# Altium schematic sheet MCU_POWER.SchDoc
size B; SheetNumber: 2; SheetTotal: 7
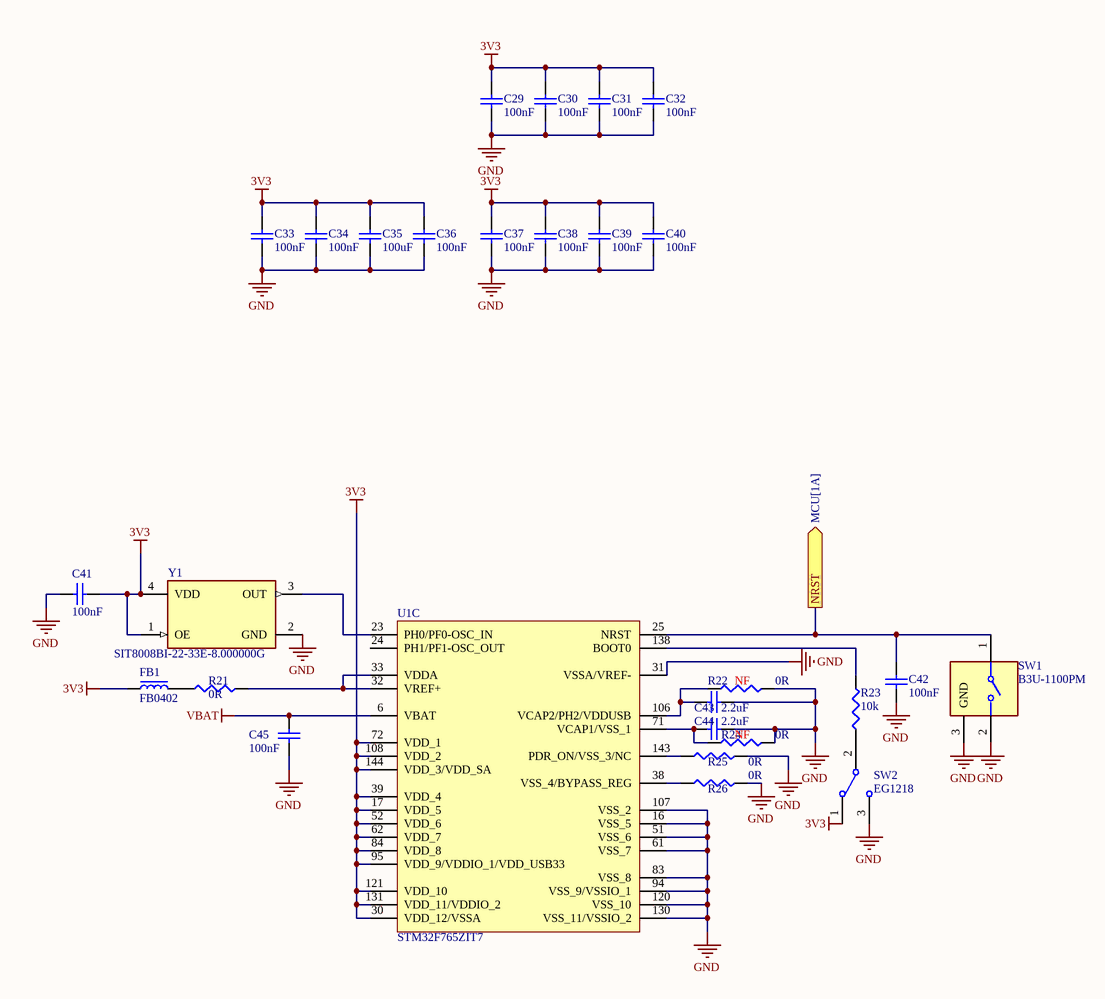
[diagram p0: MCU_POWER.SchDoc]

## Parts
C29  100nF  [0402_C]
C30  100nF  [0402_C]
C31  100nF  [0402_C]
C32  100nF  [0402_C]
C33  100nF  [0402_C]
C34  100nF  [0402_C]
C35  100uF  [0402_C]
C36  100nF  [0402_C]
C37  100nF  [0402_C]
C38  100nF  [0402_C]
C39  100nF  [0402_C]
C40  100nF  [0402_C]
C41  100nF  [0402_C]
C42  100nF  [0402_C]
C43  2.2uF  [0402_C]
C44  2.2uF  [0402_C]
C45  100nF  [0402_C]
FB1  FB0402  [0402_R]
R21  0R  [0402_R]
R22  0R  [0402_R]
R23  10k  [0402_R]
R24  0R  [0402_R]
R25  0R  [0402_R]
R26  0R  [0402_R]
SW1  B3U-1100PM  [FP-B3U-1100PM-MFG]
SW2  EG1218  [ESWI-EG1218_V]
U1  STM32F765ZIT7  [QFP50P2200X2200X160-144N]  (part C of 3)
Y1  SIT8008BI-22-33E-8.000000G  [FP-SiT8008-2-MFG]

## Ports
NRST (out, see MCU[1A])

## Nets
3V3: C29.1 C30.1 C31.1 C32.1 C33.1 C34.1 C35.1 C36.1 C37.1 C38.1 C39.1 C40.1 C41.1 FB1.1 SW2.1 U1.17(VDD_5) U1.30(VDD_12/VSSA) U1.39(VDD_4) U1.52(VDD_6) U1.62(VDD_7) U1.72(VDD_1) U1.84(VDD_8) U1.95(VDD_9/VDDIO_1/VDD_USB33) U1.108(VDD_2) U1.121(VDD_10) U1.131(VDD_11/VDDIO_2) U1.144(VDD_3/VDD_SA) Y1.1(OE) Y1.4(VDD)
GND: C29.2 C30.2 C31.2 C32.2 C33.2 C34.2 C35.2 C36.2 C37.2 C38.2 C39.2 C40.2 C41.2 C42.2 C43.2 C44.2 C45.2 R22.2 R24.2 R25.2 R26.2 SW1.2 SW1.3(GND) SW2.3 U1.16(VSS_5) U1.31(VSSA/VREF-) U1.51(VSS_6) U1.61(VSS_7) U1.83(VSS_8) U1.94(VSS_9/VSSIO_1) U1.107(VSS_2) U1.120(VSS_10) U1.130(VSS_11/VSSIO_2) Y1.2(GND)
VBAT: C45.1 U1.6(VBAT)
NRST: C42.1 SW1.1 U1.25(NRST) ; port NRST
NetC43_1: C43.1 R22.1 U1.106(VCAP2/PH2/VDDUSB)
NetC44_1: C44.1 R24.1 U1.71(VCAP1/VSS_1)
NetFB1_2: FB1.2 R21.1
NetR21_2: R21.2 U1.32(VREF+) U1.33(VDDA)
NetR23_1: R23.1 U1.138(BOOT0)
NetR23_2: R23.2 SW2.2(COM)
NetR25_1: R25.1 U1.143(PDR_ON/VSS_3/NC)
NetR26_1: R26.1 U1.38(VSS_4/BYPASS_REG)
NetU1_23: U1.23(PH0/PF0-OSC_IN) Y1.3(OUT)

Not connected (* = marked no-connect by the designer): U1 24(PH1/PF1-OSC_OUT)

## Notes on the sheet
- (near R22) NF
- (near R24) NF

## Library data of the parts
C29-C34 C36-C42 C45 = C_100nF_0402: Ceramic Capacitor, Multilayer, Ceramic, 16V, 10% +Tol, 10% -Tol, X7R, +-15% TC, 100nF, Surface Mount, 0402 inch; Manufacturer: Samsung Electro-Mechanics; Manufacturer Part Number: CL05B104KO5NNNC; Supplier: DigiKey; Supplier Part Number: 1276-1001-1-ND; RoHS: Compliant; Category: Ceramic Capacitors; Stock: 253470; Pricing: 1=0.08, 10=0.009, 50=0.0076, 100=0.0064, 500=0.0056, 1000=0.004, 2500=0.00394 (USD); Value: 100nF; Case/Package: 0402; Case Code (Imperial): 0402; Case Code (Metric): 1005; China RoHS: Compliant; Contact Plating: Tin; Depth: 500µm; Dielectric: X7R; Dielectric Material: Ceramic; Height: 500µm; Lead Free: Lead Free; Length: 1mm; Lifecycle Status: Production; Material: Ceramic; Max Operating Temperature: 125°C; Min Operating Temperature: -55°C; Mounting Technology: Surface Mount; Number of Terminals: 2; Radiation Hardening: No; REACH SVHC: Yes; Schedule B: 8532240020, 8532240020|8532240020|8532240020|8532240020|8532240020|8532240020|8532240020|8532240020|8532240020|8532240020|8532240020|8532240020|8532240020|8532240020|8532240020|8532240020|8532240020|8532240020|8532240020|8532240020|8532240020|8532240020|8532240020|85; Thickness: 558.8µm; Tolerance: 10%; Voltage: 16V; Voltage Rating: 16V; Voltage Rating (DC): 16V; Width: 500µm; ComponentLink1URL: https://datasheet.octopart.com:443/CL05B104KO5NNNC-Samsung-Electro-Mechanics-datasheet-181960518.pdf?src-supplier=IHS; ComponentLink1Description: https://datasheet.octopart.com:443/CL05B104KO5NNNC-Samsung-Electro-Mechanics-datasheet-181960518.pdf?src-supplier=IHS; ComponentLink2URL: https://datasheet.octopart.com:443/CL05B104KO5NNNC-Samsung-Electro-Mechanics-datasheet-81461623.pdf?src-supplier=Upverter; ComponentLink2Description: https://datasheet.octopart.com:443/CL05B104KO5NNNC-Samsung-Electro-Mechanics-datasheet-81461623.pdf?src-supplier=Upverter; ComponentLink3URL: https://datasheet.octopart.com/CL05B104KO5NNNC-Samsung-Electro-Mechanics-datasheet-8324245.pdf; ComponentLink3Description: https://datasheet.octopart.com/CL05B104KO5NNNC-Samsung-Electro-Mechanics-datasheet-8324245.pdf; ComponentLink4URL: https://datasheet.octopart.com/CL05B104KO5NNNC-Samsung-Electro-Mechanics-datasheet-97040617.pdf; ComponentLink4Description: https://datasheet.octopart.com/CL05B104KO5NNNC-Samsung-Electro-Mechanics-datasheet-97040617.pdf; ComponentLink5URL: https://datasheet.octopart.com/General-Multilayer-Ceramic-Capacitors-Samsung-datasheet-family-111.pdf; ComponentLink5Description: https://datasheet.octopart.com/General-Multilayer-Ceramic-Capacitors-Samsung-datasheet-family-111.pdf; ComponentLink6URL: https://datasheet.octopart.com:443/CL05B104KO5NNNC-Samsung-Electro-Mechanics-datasheet-141346863.pdf?src-supplier=Samsung+SCT; ComponentLink6Description: https://datasheet.octopart.com:443/CL05B104KO5NNNC-Samsung-Electro-Mechanics-datasheet-141346863.pdf?src-supplier=Samsung+SCT; ComponentLink7URL: https://datasheet.octopart.com:443/CL05B104KO5NNNC-Samsung-datasheet-151956582.pdf?src-supplier=SOS+electronic; ComponentLink7Description: https://datasheet.octopart.com:443/CL05B104KO5NNNC-Samsung-datasheet-151956582.pdf?src-supplier=SOS+electronic; ComponentLink8URL: https://datasheet.octopart.com:443/CL05B104KO5NNNC-Samsung-datasheet-42485123.pdf?src-supplier=Future+Electronics; ComponentLink8Description: https://datasheet.octopart.com:443/CL05B104KO5NNNC-Samsung-datasheet-42485123.pdf?src-supplier=Future+Electronics; ComponentLink9URL: https://datasheet.octopart.com:443/CL05B104KO5NNNC-Samsung-datasheet-34153835.pdf?src-supplier=Future+Electronics; ComponentLink9Description: https://datasheet.octopart.com:443/CL05B104KO5NNNC-Samsung-datasheet-34153835.pdf?src-supplier=Future+Electronics; ComponentLink10URL: https://datasheet.octopart.com:443/CL05B104KO5NNNC-Samsung-datasheet-26589024.pdf?src-supplier=Future+Electronics; ComponentLink10Description: https://datasheet.octopart.com:443/CL05B104KO5NNNC-Samsung-datasheet-26589024.pdf?src-supplier=Future+Electronics; ComponentLink11URL: https://datasheet.octopart.com:443/CL05B104KO5NNNC-Samsung-Electro-Mechanics-datasheet-149136714.pdf?src-supplier=Future+Electronics; ComponentLink11Description: https://datasheet.octopart.com:443/CL05B104KO5NNNC-Samsung-Electro-Mechanics-datasheet-149136714.pdf?src-supplier=Future+Electronics; ComponentLink12URL: https://datasheet.octopart.com:443/CL05B104KO5NNNC-Samsung-datasheet-59220082.pdf?src-supplier=TME; ComponentLink12Description: https://datasheet.octopart.com:443/CL05B104KO5NNNC-Samsung-datasheet-59220082.pdf?src-supplier=TME; ComponentLink13URL: http://sigma.octopart.com:80/rohs_certificate/General-Multilayer-Ceramic-Capacitors-Samsung-family-110.pdf?src-supplier=Compliance+Statements; ComponentLink13Description: http://sigma.octopart.com:80/rohs_certificate/General-Multilayer-Ceramic-Capacitors-Samsung-family-110.pdf?src-supplier=Compliance+Statements; ComponentLink14URL: http://sigma.octopart.com:80/rohs_statement/General-Multilayer-Ceramic-Capacitors-Samsung-family-132.pdf?src-supplier=Compliance+Statements; ComponentLink14Description: http://sigma.octopart.com:80/rohs_statement/General-Multilayer-Ceramic-Capacitors-Samsung-family-132.pdf?src-supplier=Compliance+Statements; ComponentLink15URL: http://sigma.octopart.com:80/reach_statement/General-Multilayer-Ceramic-Capacitors-Samsung-family-133.pdf?src-supplier=Compliance+Statements; ComponentLink15Description: http://sigma.octopart.com:80/reach_statement/General-Multilayer-Ceramic-Capacitors-Samsung-family-133.pdf?src-supplier=Compliance+Statements; LCSC Part #: C1525
C35 = C_4.7uF_0402: CAP CER 4.7UF 16V X5R 0402; Manufacturer: Samsung; Manufacturer Part Number: CL05A475MO5NUNC; Dielectric Material: Ceramic; Multilayer: Yes; Tolerance  (fill in as +-): 20%; Supplier: Digikey; Supplier Part Number: 1276-6836-1-ND; RoHS: Yes; Category: Ceramic Capacitors; Stock: 200989; Pricing: 1=0.43, 10=0.252, 50=0.1826, 100=0.161, 500=0.12446, 1000=0.11305, 2500=0.10094, 5000=0.0936, 10000=0.08752, 20000=0.08248, 30000=0.07994, 50000=0.07712, 70000=0.07547, 100000=0.07387 (USD); Mounting Technology: Surface Mount; Pins: 2; Package Shape: Rectangular; Case/Package: 0402; Terminal Finish: Nickel; Min Operating Temperature: -55°C; Max Operating Temperature: 85°C; JESD-609 Code: e3; Value: 4.7uF; Capacitor Type: Ceramic; Package Style: SMTMeter; Packaging: Tape and Reel; Tolerance (fill in as +-): 20%; Rated DC Voltage (URdc): 16V; Temperature Characteristics Code: X5R; Termination: Wraparound; Length: 1mm; Width: 0.5mm; Height: 0.7mm; Reach SVHC Compliant: Yes; RoHS Compliant: Yes; ComponentLink1URL: https://datasheet.ciiva.com:443/pdfs/VipMasterIC/IC/SEMS/SEMS-S-A0008384515/SEMS-S-A0008898881-1.pdf?src-supplier=IHS+Markit; ComponentLink1Description: https://datasheet.ciiva.com:443/pdfs/VipMasterIC/IC/SEMS/SEMS-S-A0008384515/SEMS-S-A0008898881-1.pdf?src-supplier=IHS+Markit; ComponentLink2URL: http://www.farnell.com/datasheets/2710653.pdf?src-supplier=Farnell; ComponentLink2Description: http://www.farnell.com/datasheets/2710653.pdf?src-supplier=Farnell; ComponentLink3URL: http://www.samsungsem.com/kr/support/product-search/mlcc/CL05A475MO5NUNC.jsp?src-supplier=Digikey; ComponentLink3Description: http://www.samsungsem.com/kr/support/product-search/mlcc/CL05A475MO5NUNC.jsp?src-supplier=Digikey; ComponentLink4URL: http://www.farnell.com/datasheets/2710653.pdf?src-supplier=Newark; ComponentLink4Description: http://www.farnell.com/datasheets/2710653.pdf?src-supplier=Newark; ComponentLink5URL: http://www.farnell.com/datasheets/2710653.pdf?src-supplier=Element14; ComponentLink5Description: http://www.farnell.com/datasheets/2710653.pdf?src-supplier=Element14; ComponentLink6URL: https://datasheet.octopart.com/CL05A475MO5NUNC-Samsung-Electro-Mechanics-datasheet-123102911.pdf?src-supplier=Future+Electronics; ComponentLink6Description: https://datasheet.octopart.com/CL05A475MO5NUNC-Samsung-Electro-Mechanics-datasheet-123102911.pdf?src-supplier=Future+Electronics; LCSC Part #: C318563
C43 C44 = C_2.2uF_0402_1: Ceramic Capacitor, Ceramic, 25V, 20% +Tol, 20% -Tol, X5R, 15% TC, 2.2uF, Surface Mount, 0402; Manufacturer: Yageo Group; Manufacturer Part Number: CC0402MRX5R8BB225; Dielectric: C0G; Insulation Resistance: 10GΩ; Temperature Coefficient: 30ppm/°C; Voltage Rating: 50V; Value: 2.2µF; Case/Package: 0402; Case Code (Imperial): 0402; Case Code (Metric): 1005; China RoHS: Compliant; Composition: Ceramic; Depth: 500µm; Dielectric Material: Ceramic; Halogen Free: Halogen Free; Height: 500µm; Lead Free: Lead Free; Length: 1mm; Lifecycle Status: Production; Max Operating Temperature: 125°C; Min Operating Temperature: -55°C; Mounting Technology: Surface Mount; Pins: 2; Number of Terminals: 2; Packaging: Tape & Reel (TR); Radiation Hardening: No; REACH SVHC: Yes; Schedule B: 8532240020, 8532240020|8532240020|8532240020|8532240020|8532240020; Termination: SMD/SMT; Thickness: 558.8µm; Voltage Rating (DC): 50V; Weight: 652.039032µg; Width: 500µm; ComponentLink1URL: https://datasheet.octopart.com:443/CC0402CRNPO9BN2R7-Yageo-datasheet-182140217.pdf?src-supplier=IHS; ComponentLink1Description: https://datasheet.octopart.com:443/CC0402CRNPO9BN2R7-Yageo-datasheet-182140217.pdf?src-supplier=IHS; ComponentLink2URL: https://datasheet.octopart.com:443/CC0402CRNPO9BN2R7-Yageo-datasheet-151948684.pdf?src-supplier=Farnell; ComponentLink2Description: https://datasheet.octopart.com:443/CC0402CRNPO9BN2R7-Yageo-datasheet-151948684.pdf?src-supplier=Farnell; ComponentLink3URL: https://datasheet.octopart.com:443/CC0402CRNPO9BN2R7-Yageo-datasheet-181966735.pdf?src-supplier=Farnell; ComponentLink3Description: https://datasheet.octopart.com:443/CC0402CRNPO9BN2R7-Yageo-datasheet-181966735.pdf?src-supplier=Farnell; ComponentLink4URL: https://datasheet.octopart.com:443/CC0402CRNPO9BN2R7-Yageo-datasheet-137875056.pdf?src-supplier=Future+Electronics; ComponentLink4Description: https://datasheet.octopart.com:443/CC0402CRNPO9BN2R7-Yageo-datasheet-137875056.pdf?src-supplier=Future+Electronics; ComponentLink5URL: https://datasheet.octopart.com:443/CC0402CRNPO9BN2R7-Yageo-datasheet-136957424.pdf?src-supplier=Future+Electronics; ComponentLink5Description: https://datasheet.octopart.com:443/CC0402CRNPO9BN2R7-Yageo-datasheet-136957424.pdf?src-supplier=Future+Electronics; ComponentLink6URL: https://datasheet.octopart.com:443/CC0402CRNPO9BN2R7-Yageo-datasheet-137700082.pdf?src-supplier=Future+Electronics; ComponentLink6Description: https://datasheet.octopart.com:443/CC0402CRNPO9BN2R7-Yageo-datasheet-137700082.pdf?src-supplier=Future+Electronics; ComponentLink7URL: https://datasheet.octopart.com:443/CC0402CRNPO9BN2R7-Yageo-datasheet-78855684.pdf?src-supplier=Future+Electronics; ComponentLink7Description: https://datasheet.octopart.com:443/CC0402CRNPO9BN2R7-Yageo-datasheet-78855684.pdf?src-supplier=Future+Electronics; ComponentLink8URL: https://datasheet.octopart.com:443/CC0402CRNPO9BN2R7-Yageo-datasheet-24578986.pdf?src-supplier=Future+Electronics; ComponentLink8Description: https://datasheet.octopart.com:443/CC0402CRNPO9BN2R7-Yageo-datasheet-24578986.pdf?src-supplier=Future+Electronics; ComponentLink9URL: https://datasheet.octopart.com:443/CC0402CRNPO9BN2R7-Yageo-datasheet-16730043.pdf?src-supplier=Future+Electronics; ComponentLink9Description: https://datasheet.octopart.com:443/CC0402CRNPO9BN2R7-Yageo-datasheet-16730043.pdf?src-supplier=Future+Electronics; ComponentLink10URL: https://datasheet.octopart.com:443/CC0402CRNPO9BN2R7-Yageo-datasheet-12589826.pdf?src-supplier=Future+Electronics; ComponentLink10Description: https://datasheet.octopart.com:443/CC0402CRNPO9BN2R7-Yageo-datasheet-12589826.pdf?src-supplier=Future+Electronics; ComponentLink11URL: https://datasheet.octopart.com:443/CC0402CRNPO9BN2R7-Yageo-datasheet-10406438.pdf?src-supplier=Newark; ComponentLink11Description: https://datasheet.octopart.com:443/CC0402CRNPO9BN2R7-Yageo-datasheet-10406438.pdf?src-supplier=Newark; ComponentLink12URL: https://datasheet.octopart.com:443/CC0402CRNPO9BN2R7-Yageo-datasheet-65873193.pdf?src-supplier=Newark; ComponentLink12Description: https://datasheet.octopart.com:443/CC0402CRNPO9BN2R7-Yageo-datasheet-65873193.pdf?src-supplier=Newark; ComponentLink13URL: https://datasheet.octopart.com:443/CC0402CRNPO9BN2R7-Yageo-datasheet-68296204.pdf?src-supplier=Megastar; ComponentLink13Description: https://datasheet.octopart.com:443/CC0402CRNPO9BN2R7-Yageo-datasheet-68296204.pdf?src-supplier=Megastar; ComponentLink14URL: http://sigma.octopart.com:80/rohs_statement/Yageo-company-2.pdf?src-supplier=Compliance+Statements; ComponentLink14Description: http://sigma.octopart.com:80/rohs_statement/Yageo-company-2.pdf?src-supplier=Compliance+Statements; ComponentLink15URL: http://sigma.octopart.com:80/conflict_mineral_statement/Yageo-company-3.pdf?src-supplier=Compliance+Statements; ComponentLink15Description: http://sigma.octopart.com:80/conflict_mineral_statement/Yageo-company-3.pdf?src-supplier=Compliance+Statements; LCSC Part #: C723363; Supplier: DigiKey; Supplier Part Number: 13-CC0402MRX5R8BB225CT-ND; RoHS: Compliant; Category: Ceramic Capacitors; Stock: 20337; Pricing: 1=0.3, 10=0.176, 50=0.1282, 100=0.1135, 500=0.08336, 1000=0.08124, 2500=0.07321, 5000=0.06838 (USD); Material: Ceramic; ComponentLink16URL: https://datasheet.octopart.com:443/CC0402MRX5R8BB225-Yageo-datasheet-170350636.pdf?src-supplier=IHS; ComponentLink16Description: https://datasheet.octopart.com:443/CC0402MRX5R8BB225-Yageo-datasheet-170350636.pdf?src-supplier=IHS; ComponentLink17URL: https://datasheet.octopart.com:443/CC0402MRX5R8BB225-Yageo-datasheet-78855684.pdf?src-supplier=Upverter; ComponentLink17Description: https://datasheet.octopart.com:443/CC0402MRX5R8BB225-Yageo-datasheet-78855684.pdf?src-supplier=Upverter; ComponentLink18URL: https://datasheet.octopart.com:443/CC0402MRX5R8BB225-Yageo-datasheet-181967557.pdf?src-supplier=Farnell; ComponentLink18Description: https://datasheet.octopart.com:443/CC0402MRX5R8BB225-Yageo-datasheet-181967557.pdf?src-supplier=Farnell; ComponentLink19URL: https://datasheet.octopart.com:443/CC0402MRX5R8BB225-Yageo-datasheet-181967556.pdf?src-supplier=Farnell; ComponentLink19Description: https://datasheet.octopart.com:443/CC0402MRX5R8BB225-Yageo-datasheet-181967556.pdf?src-supplier=Farnell; ComponentLink20URL: https://datasheet.octopart.com:443/CC0402MRX5R8BB225-Yageo-datasheet-145016144.pdf?src-supplier=ODG+(Origin+Data+Global); ComponentLink20Description: https://datasheet.octopart.com:443/CC0402MRX5R8BB225-Yageo-datasheet-145016144.pdf?src-supplier=ODG+(Origin+Data+Global); ComponentLink21URL: https://datasheet.octopart.com/CC0402MRX5R8BB225-Yageo-datasheet-86397281.pdf; ComponentLink21Description: https://datasheet.octopart.com/CC0402MRX5R8BB225-Yageo-datasheet-86397281.pdf; Supplier 1: DigiKey; Supplier Part Number 1: 13-CC0402KRX5R8BB225CT-ND
FB1 = FB_0402: Ferrite Beads Multi-Layer 600Ohm 25% 100MHz 300mA 520mOhm DCR 0402 Paper T/R; Manufacturer: Murata Electronics; Manufacturer Part Number: BLM15AG601SN1D; DC Resistance (DCR): 520mΩ; Impedance: 600Ω; Material: Ferrite, Steel; Number of Circuits: 1; Shielding: Unshielded; Distributor Link: *; LCSC Part #: C76884; Supplier: DigiKey; Supplier Part Number: 490-1006-1-ND; RoHS: Compliant; Category: Ferrite Beads and Chips; Stock: 347218; Pricing: 1=0.1, 10=0.043, 25=0.0376, 50=0.034, 100=0.0305, 250=0.02632, 500=0.02346, 1000=0.02083, 5000=0.01546, 10000=0.01341, 20000=0.01188 (USD); Case/Package: 0402; Case Code (Imperial): 0402; Case Code (Metric): 1005; Core Material: Ferrite; Current Rating: 300mA; DC Current: 300mA; Depth: 550µm; Frequency: 100MHz; Height: 500µm; Lead Free: Lead Free; Length: 1mm; Lifecycle Status: Production; Max Current Rating: 300mA; Max DC Current: 300mA; Clock Frequency: 100MHz; Max Operating Temperature: 125°C; Military Standard: Not; Min Operating Temperature: -55°C; Number of Lines: 1; Pins: 2; Number of Terminals: 2; Packaging: Tape and Reel; Radiation Hardening: No; REACH SVHC: Yes; RMS Current (Irms): 300mA; Schedule B: 8504500000, 8504500000|8504500000, 8504500000|8504500000|8504500000, 8504500000|8504500000|8504500000|8504500000; ESR: 520mΩ; Termination: SMD/SMT; Test Frequency: 100MHz; Tolerance: 25%; Width: 500µm; ComponentLink1URL: https://datasheet.octopart.com:443/BLM15AG601SN1D-Murata-datasheet-180806368.pdf?src-supplier=Newark; ComponentLink1Description: https://datasheet.octopart.com:443/BLM15AG601SN1D-Murata-datasheet-180806368.pdf?src-supplier=Newark; ComponentLink2URL: https://datasheet.octopart.com:443/BLM15AG601SN1D-Murata-datasheet-12522583.pdf?src-supplier=Upverter; ComponentLink2Description: https://datasheet.octopart.com:443/BLM15AG601SN1D-Murata-datasheet-12522583.pdf?src-supplier=Upverter; ComponentLink3URL: https://datasheet.octopart.com:443/BLM15AG601SN1D-Murata-datasheet-10083551.pdf?src-supplier=Upverter; ComponentLink3Description: https://datasheet.octopart.com:443/BLM15AG601SN1D-Murata-datasheet-10083551.pdf?src-supplier=Upverter; ComponentLink4URL: https://datasheet.octopart.com:443/BLM15AG601SN1D-Murata-datasheet-8508678.pdf?src-supplier=Upverter; ComponentLink4Description: https://datasheet.octopart.com:443/BLM15AG601SN1D-Murata-datasheet-8508678.pdf?src-supplier=Upverter; ComponentLink5URL: https://datasheet.octopart.com:443/BLM15AG601SN1D-Murata-datasheet-70271.pdf?src-supplier=element14+APAC; ComponentLink5Description: https://datasheet.octopart.com:443/BLM15AG601SN1D-Murata-datasheet-70271.pdf?src-supplier=element14+APAC; ComponentLink6URL: https://datasheet.octopart.com:443/BLM15AG601SN1D-Murata-datasheet-11772092.pdf?src-supplier=Future+Electronics; ComponentLink6Description: https://datasheet.octopart.com:443/BLM15AG601SN1D-Murata-datasheet-11772092.pdf?src-supplier=Future+Electronics; ComponentLink7URL: https://datasheet.octopart.com:443/BLM15AG601SN1D-Murata-datasheet-13536432.pdf?src-supplier=Future+Electronics; ComponentLink7Description: https://datasheet.octopart.com:443/BLM15AG601SN1D-Murata-datasheet-13536432.pdf?src-supplier=Future+Electronics; ComponentLink8URL: https://datasheet.octopart.com:443/BLM15AG601SN1D-Murata-datasheet-79879196.pdf?src-supplier=Future+Electronics; ComponentLink8Description: https://datasheet.octopart.com:443/BLM15AG601SN1D-Murata-datasheet-79879196.pdf?src-supplier=Future+Electronics; ComponentLink9URL: https://datasheet.octopart.com:443/BLM15AG601SN1D-Murata-datasheet-13563506.pdf?src-supplier=Future+Electronics; ComponentLink9Description: https://datasheet.octopart.com:443/BLM15AG601SN1D-Murata-datasheet-13563506.pdf?src-supplier=Future+Electronics; ComponentLink10URL: https://datasheet.octopart.com:443/BLM15AG601SN1D-Murata-datasheet-12545319.pdf?src-supplier=Future+Electronics; ComponentLink10Description: https://datasheet.octopart.com:443/BLM15AG601SN1D-Murata-datasheet-12545319.pdf?src-supplier=Future+Electronics; ComponentLink11URL: https://datasheet.octopart.com:443/BLM15AG601SN1D-Murata-datasheet-141257741.pdf?src-supplier=Ciiva; ComponentLink11Description: https://datasheet.octopart.com:443/BLM15AG601SN1D-Murata-datasheet-141257741.pdf?src-supplier=Ciiva; ComponentLink12URL: https://datasheet.octopart.com:443/BLM15AG601SN1D-Murata-datasheet-138706486.pdf?src-supplier=Ciiva; ComponentLink12Description: https://datasheet.octopart.com:443/BLM15AG601SN1D-Murata-datasheet-138706486.pdf?src-supplier=Ciiva; ComponentLink13URL: https://datasheet.octopart.com:443/BLM15AG601SN1D-Murata-datasheet-155367977.pdf?src-supplier=TME; ComponentLink13Description: https://datasheet.octopart.com:443/BLM15AG601SN1D-Murata-datasheet-155367977.pdf?src-supplier=TME; ComponentLink14URL: https://datasheet.octopart.com:443/BLM15AG601SN1D-Murata-datasheet-65816644.pdf?src-supplier=TME; ComponentLink14Description: https://datasheet.octopart.com:443/BLM15AG601SN1D-Murata-datasheet-65816644.pdf?src-supplier=TME; ComponentLink15URL: https://datasheet.octopart.com:443/BLM15AG601SN1D-Murata-datasheet-102761981.pdf?src-supplier=Megastar; ComponentLink15Description: https://datasheet.octopart.com:443/BLM15AG601SN1D-Murata-datasheet-102761981.pdf?src-supplier=Megastar; ComponentLink16URL: https://datasheet.octopart.com/BLM15AG601SN1D-Murata-datasheet-37129980.pdf; ComponentLink16Description: https://datasheet.octopart.com/BLM15AG601SN1D-Murata-datasheet-37129980.pdf; ComponentLink17URL: https://datasheet.octopart.com:443/BLM15AG601SN1D-Murata-datasheet-14066398.pdf?src-supplier=iiiC; ComponentLink17Description: https://datasheet.octopart.com:443/BLM15AG601SN1D-Murata-datasheet-14066398.pdf?src-supplier=iiiC; ComponentLink18URL: http://sigma.octopart.com:80/reach_statement/Murata-company-16.pdf?src-supplier=Compliance+Statements; ComponentLink18Description: http://sigma.octopart.com:80/reach_statement/Murata-company-16.pdf?src-supplier=Compliance+Statements
R21 R22 R24-R26 = R_0R_0402: GENERAL PURPOSE CHIP RESISTOR Metal Glaze/thick Film, 0.0625W, 0ohm, Surface Mount, 0402; Manufacturer: Yageo Group; Manufacturer Part Number: RC0402JR-070RL; Max Power Dissipation: 63mW; Power Dissipation: 62.5mW; Value: 0Ω; Temperature Coefficient: 200ppm/°C; Tolerance: 5%; Voltage Rating: 50V; Supplier: DigiKey; Supplier Part Number: 311-0.0JRDKR-ND; RoHS: Compliant; Category: Chip SMD Resistors; Stock: 23041339; Pricing: 1=0.1, 10=0.010, 25=0.0064, 50=0.0054, 100=0.0047, 250=0.00392, 500=0.00346, 1000=0.00304, 5000=0.0023 (USD); Case/Package: 0402; Case Code (Imperial): 0402; China RoHS: Non-Compliant; Composition: Thick Film; Contact Plating: Tin; Depth: 500µm; Features: Moisture Resistant; Height: 350µm; Lead Free: Lead Free; Length: 1mm; Lifecycle Status: Production; Max Operating Temperature: 155°C; Military Standard: Not; Min Operating Temperature: -55°C; Mounting Technology: Surface Mount; Pins: 2; Number of Terminals: 2; Number of Terminations: 2; Packaging: Tape & Reel; Power Rating: 63mW; Radiation Hardening: No; REACH SVHC: Yes; Schedule B: 8533290000, 8533290000|8533290000, 8533290000|8533290000|8533290000, 8533290000|8533290000|8533290000|8533290000; Termination: SMD/SMT; Voltage Rating (DC): 50V; Width: 500µm; ComponentLink1URL: https://datasheet.octopart.com:443/RC0402JR-070RL-Yageo-datasheet-182189538.pdf?src-supplier=IHS; ComponentLink1Description: https://datasheet.octopart.com:443/RC0402JR-070RL-Yageo-datasheet-182189538.pdf?src-supplier=IHS; ComponentLink2URL: https://datasheet.octopart.com:443/RC0402JR-070RL-Yageo-datasheet-10408619.pdf?src-supplier=Newark; ComponentLink2Description: https://datasheet.octopart.com:443/RC0402JR-070RL-Yageo-datasheet-10408619.pdf?src-supplier=Newark; ComponentLink3URL: https://datasheet.octopart.com:443/RC0402JR-070RL-Yageo-datasheet-12531192.pdf?src-supplier=Seeed+Studio; ComponentLink3Description: https://datasheet.octopart.com:443/RC0402JR-070RL-Yageo-datasheet-12531192.pdf?src-supplier=Seeed+Studio; ComponentLink4URL: https://datasheet.octopart.com:443/RC0402JR-070RL-Yageo-datasheet-8324527.pdf?src-supplier=TME; ComponentLink4Description: https://datasheet.octopart.com:443/RC0402JR-070RL-Yageo-datasheet-8324527.pdf?src-supplier=TME; ComponentLink5URL: https://datasheet.octopart.com:443/RC0402JR-070RL-Yageo-datasheet-62067350.pdf?src-supplier=Farnell; ComponentLink5Description: https://datasheet.octopart.com:443/RC0402JR-070RL-Yageo-datasheet-62067350.pdf?src-supplier=Farnell; ComponentLink6URL: https://datasheet.octopart.com:443/RC0402JR-070RL-Yageo-datasheet-8329306.pdf?src-supplier=element14; ComponentLink6Description: https://datasheet.octopart.com:443/RC0402JR-070RL-Yageo-datasheet-8329306.pdf?src-supplier=element14; ComponentLink7URL: https://datasheet.octopart.com:443/RC0402JR-070RL-Yageo-datasheet-505231.pdf?src-supplier=element14; ComponentLink7Description: https://datasheet.octopart.com:443/RC0402JR-070RL-Yageo-datasheet-505231.pdf?src-supplier=element14; ComponentLink8URL: https://datasheet.octopart.com:443/RC0402JR-070RL-Yageo-datasheet-175423674.pdf?src-supplier=SOS+electronic; ComponentLink8Description: https://datasheet.octopart.com:443/RC0402JR-070RL-Yageo-datasheet-175423674.pdf?src-supplier=SOS+electronic; ComponentLink9URL: https://datasheet.octopart.com:443/RC0402JR-070RL-Yageo-datasheet-164759695.pdf?src-supplier=Future+Electronics; ComponentLink9Description: https://datasheet.octopart.com:443/RC0402JR-070RL-Yageo-datasheet-164759695.pdf?src-supplier=Future+Electronics; ComponentLink10URL: https://datasheet.octopart.com:443/RC0402JR-070RL-Yageo-datasheet-137700087.pdf?src-supplier=Future+Electronics; ComponentLink10Description: https://datasheet.octopart.com:443/RC0402JR-070RL-Yageo-datasheet-137700087.pdf?src-supplier=Future+Electronics; ComponentLink11URL: https://datasheet.octopart.com/RC0402JR-070RL-Yageo-datasheet-73766026.pdf; ComponentLink11Description: https://datasheet.octopart.com/RC0402JR-070RL-Yageo-datasheet-73766026.pdf; ComponentLink12URL: http://sigma.octopart.com:80/rohs_statement/Yageo-company-2.pdf?src-supplier=Compliance+Statements; ComponentLink12Description: http://sigma.octopart.com:80/rohs_statement/Yageo-company-2.pdf?src-supplier=Compliance+Statements; ComponentLink13URL: http://sigma.octopart.com:80/conflict_mineral_statement/Yageo-company-3.pdf?src-supplier=Compliance+Statements; ComponentLink13Description: http://sigma.octopart.com:80/conflict_mineral_statement/Yageo-company-3.pdf?src-supplier=Compliance+Statements; LCSC Part #: C60485
R23 = R_10k_0402: RES SMD 10K OHM 0.1% 1/16W 0402; Manufacturer: Yageo Group; Manufacturer Part Number: RC0402FR-071KL; Power Dissipation: 62.5mW; Power Rating: 63mW; Value: 10kΩ; Temperature Coefficient: 100ppm/°C; Tolerance: 1%; Voltage Rating: 50V; LCSC Part #: C191915; Supplier: DigiKey; Supplier Part Number: 311-1.00KLRTR-ND; RoHS: Compliant; Category: Chip SMD Resistors; Stock: 4926888; Pricing: 10000=0.00204, 20000=0.002, 30000=0.00196, 50000=0.00182, 70000=0.00181 (USD); Case/Package: 0402; Case Code (Imperial): 0402; Case Code (Metric): 0402; China RoHS: Non-Compliant; Composition: Thick Film; Depth: 500µm; Height: 350µm; Lead Free: Lead Free; Length: 1mm; Lifecycle Status: Production; Max Operating Temperature: 155°C; Military Standard: Not; Min Operating Temperature: -55°C; Mounting Technology: Surface Mount; Pins: 2; Number of Terminals: 2; Packaging: Tape & Reel; REACH SVHC: Yes; Schedule B: 8533210045, 8533210045|8533210045|8533210045|8533210045|8533210045|8533210045|8533210045|8533210045|8533210045|8533210045|8533210045|8533210045|8533210045|8533210045|8533210045|8533210045|8533210045|8533210045|8533210045|8533210045|8533210045|8533210045|8533210045|85; Termination: SMD/SMT; Voltage Rating (AC): 50V; Voltage Rating (DC): 50V; Width: 500µm; Working Voltage: 50V; ComponentLink1URL: https://datasheet.octopart.com:443/RC0402FR-071KL-Yageo-datasheet-175887523.pdf?src-supplier=IHS; ComponentLink1Description: https://datasheet.octopart.com:443/RC0402FR-071KL-Yageo-datasheet-175887523.pdf?src-supplier=IHS; ComponentLink2URL: https://datasheet.octopart.com:443/RC0402FR-071KL-Yageo-datasheet-164759695.pdf?src-supplier=Upverter; ComponentLink2Description: https://datasheet.octopart.com:443/RC0402FR-071KL-Yageo-datasheet-164759695.pdf?src-supplier=Upverter; ComponentLink3URL: https://datasheet.octopart.com:443/RC0402FR-071KL-Yageo-datasheet-103092701.pdf?src-supplier=Upverter; ComponentLink3Description: https://datasheet.octopart.com:443/RC0402FR-071KL-Yageo-datasheet-103092701.pdf?src-supplier=Upverter; ComponentLink4URL: https://sigma.octopart.com:443/138820526/technical_drawing/Yageo-RC0402FR-071KL.pdf?src-supplier=Upverter; ComponentLink4Description: https://sigma.octopart.com:443/138820526/technical_drawing/Yageo-RC0402FR-071KL.pdf?src-supplier=Upverter; ComponentLink5URL: https://datasheet.octopart.com:443/RC0402FR-071KL-Yageo-datasheet-98239111.pdf?src-supplier=Upverter; ComponentLink5Description: https://datasheet.octopart.com:443/RC0402FR-071KL-Yageo-datasheet-98239111.pdf?src-supplier=Upverter; ComponentLink6URL: https://datasheet.octopart.com:443/RC0402FR-071KL-Yageo-datasheet-10408619.pdf?src-supplier=Newark; ComponentLink6Description: https://datasheet.octopart.com:443/RC0402FR-071KL-Yageo-datasheet-10408619.pdf?src-supplier=Newark; ComponentLink7URL: https://datasheet.octopart.com:443/RC0402FR-071KL-Yageo-datasheet-8324527.pdf?src-supplier=Newark; ComponentLink7Description: https://datasheet.octopart.com:443/RC0402FR-071KL-Yageo-datasheet-8324527.pdf?src-supplier=Newark; ComponentLink8URL: https://datasheet.octopart.com:443/RC0402FR-071KL-Yageo-datasheet-62067350.pdf?src-supplier=Farnell; ComponentLink8Description: https://datasheet.octopart.com:443/RC0402FR-071KL-Yageo-datasheet-62067350.pdf?src-supplier=Farnell; ComponentLink9URL: https://datasheet.octopart.com:443/RC0402FR-071KL-Yageo-datasheet-12531192.pdf?src-supplier=Future+Electronics; ComponentLink9Description: https://datasheet.octopart.com:443/RC0402FR-071KL-Yageo-datasheet-12531192.pdf?src-supplier=Future+Electronics; ComponentLink10URL: https://datasheet.octopart.com:443/RC0402FR-071KL-Yageo-datasheet-137700087.pdf?src-supplier=Future+Electronics; ComponentLink10Description: https://datasheet.octopart.com:443/RC0402FR-071KL-Yageo-datasheet-137700087.pdf?src-supplier=Future+Electronics; ComponentLink11URL: https://datasheet.octopart.com:443/RC0402FR-071KL-Yageo-datasheet-8324255.pdf?src-supplier=Future+Electronics; ComponentLink11Description: https://datasheet.octopart.com:443/RC0402FR-071KL-Yageo-datasheet-8324255.pdf?src-supplier=Future+Electronics; ComponentLink12URL: https://datasheet.octopart.com:443/RC0402FR-071KL-Yageo-datasheet-8329306.pdf?src-supplier=element14; ComponentLink12Description: https://datasheet.octopart.com:443/RC0402FR-071KL-Yageo-datasheet-8329306.pdf?src-supplier=element14; ComponentLink13URL: https://datasheet.octopart.com:443/RC0402FR-071KL-Yageo-datasheet-505231.pdf?src-supplier=element14; ComponentLink13Description: https://datasheet.octopart.com:443/RC0402FR-071KL-Yageo-datasheet-505231.pdf?src-supplier=element14; ComponentLink14URL: https://datasheet.octopart.com:443/RC0402FR-071KL-Yageo-datasheet-175423674.pdf?src-supplier=SOS+electronic; ComponentLink14Description: https://datasheet.octopart.com:443/RC0402FR-071KL-Yageo-datasheet-175423674.pdf?src-supplier=SOS+electronic; ComponentLink15URL: https://datasheet.octopart.com:443/RC0402FR-071KL-Yageo-datasheet-148775077.pdf?src-supplier=TME; ComponentLink15Description: https://datasheet.octopart.com:443/RC0402FR-071KL-Yageo-datasheet-148775077.pdf?src-supplier=TME; ComponentLink16URL: https://datasheet.octopart.com:443/RC0402FR-071KL-Yageo-datasheet-79472498.pdf?src-supplier=Megastar; ComponentLink16Description: https://datasheet.octopart.com:443/RC0402FR-071KL-Yageo-datasheet-79472498.pdf?src-supplier=Megastar; ComponentLink17URL: https://datasheet.octopart.com/RC0402FR-071KL-Yageo-datasheet-73766026.pdf; ComponentLink17Description: https://datasheet.octopart.com/RC0402FR-071KL-Yageo-datasheet-73766026.pdf; ComponentLink18URL: http://sigma.octopart.com:80/rohs_statement/Yageo-company-2.pdf?src-supplier=Compliance+Statements; ComponentLink18Description: http://sigma.octopart.com:80/rohs_statement/Yageo-company-2.pdf?src-supplier=Compliance+Statements; ComponentLink19URL: http://sigma.octopart.com:80/conflict_mineral_statement/Yageo-company-3.pdf?src-supplier=Compliance+Statements; ComponentLink19Description: http://sigma.octopart.com:80/conflict_mineral_statement/Yageo-company-3.pdf?src-supplier=Compliance+Statements; Contact Plating: Tin; Features: Automotive AEC-Q200; Max Power Dissipation: 63mW; Number of Terminations: 2; Radiation Hardening: No; ComponentLink20URL: https://sigma.octopart.com:443/138766958/technical_drawing/Panasonic-ERA-2AEB103X.pdf?src-supplier=Upverter; ComponentLink20Description: https://sigma.octopart.com:443/138766958/technical_drawing/Panasonic-ERA-2AEB103X.pdf?src-supplier=Upverter; ComponentLink21URL: https://datasheet.octopart.com:443/ERA-2AEB103X-Panasonic-datasheet-62287448.pdf?src-supplier=Future+Electronics; ComponentLink21Description: https://datasheet.octopart.com:443/ERA-2AEB103X-Panasonic-datasheet-62287448.pdf?src-supplier=Future+Electronics; ComponentLink22URL: https://datasheet.octopart.com:443/ERA-2AEB103X-Panasonic-datasheet-12510007.pdf?src-supplier=Future+Electronics; ComponentLink22Description: https://datasheet.octopart.com:443/ERA-2AEB103X-Panasonic-datasheet-12510007.pdf?src-supplier=Future+Electronics; ComponentLink23URL: https://datasheet.octopart.com:443/ERA-2AEB103X-Panasonic-datasheet-11763931.pdf?src-supplier=Future+Electronics; ComponentLink23Description: https://datasheet.octopart.com:443/ERA-2AEB103X-Panasonic-datasheet-11763931.pdf?src-supplier=Future+Electronics; ComponentLink24URL: https://datasheet.octopart.com:443/ERA-2AEB103X-Panasonic-datasheet-10840895.pdf?src-supplier=Future+Electronics; ComponentLink24Description: https://datasheet.octopart.com:443/ERA-2AEB103X-Panasonic-datasheet-10840895.pdf?src-supplier=Future+Electronics; ComponentLink25URL: https://datasheet.octopart.com:443/ERA-2AEB103X-Panasonic-datasheet-8367715.pdf?src-supplier=Future+Electronics; ComponentLink25Description: https://datasheet.octopart.com:443/ERA-2AEB103X-Panasonic-datasheet-8367715.pdf?src-supplier=Future+Electronics; ComponentLink26URL: https://datasheet.octopart.com:443/ERA-2AEB103X-Panasonic-datasheet-5392808.pdf?src-supplier=Future+Electronics; ComponentLink26Description: https://datasheet.octopart.com:443/ERA-2AEB103X-Panasonic-datasheet-5392808.pdf?src-supplier=Future+Electronics; ComponentLink27URL: https://datasheet.octopart.com:443/ERA-2AEB103X-Panasonic-datasheet-136531316.pdf?src-supplier=TME; ComponentLink27Description: https://datasheet.octopart.com:443/ERA-2AEB103X-Panasonic-datasheet-136531316.pdf?src-supplier=TME; ComponentLink28URL: https://datasheet.octopart.com:443/ERA2AEB103X-Panasonic-datasheet-188913046.pdf?src-supplier=TME; ComponentLink28Description: https://datasheet.octopart.com:443/ERA2AEB103X-Panasonic-datasheet-188913046.pdf?src-supplier=TME; ComponentLink29URL: https://datasheet.octopart.com:443/ERA-2AEB103X-Panasonic-datasheet-13266200.pdf?src-supplier=_legacy+Avnet; ComponentLink29Description: https://datasheet.octopart.com:443/ERA-2AEB103X-Panasonic-datasheet-13266200.pdf?src-supplier=_legacy+Avnet; ComponentLink30URL: https://datasheet.octopart.com:443/ERA2AEB103X-Panasonic-datasheet-5311861.pdf?src-supplier=Newark; ComponentLink30Description: https://datasheet.octopart.com:443/ERA2AEB103X-Panasonic-datasheet-5311861.pdf?src-supplier=Newark; ComponentLink31URL: https://datasheet.octopart.com:443/ERA-2AEB103X-Panasonic-datasheet-61114971.pdf?src-supplier=Newark; ComponentLink31Description: https://datasheet.octopart.com:443/ERA-2AEB103X-Panasonic-datasheet-61114971.pdf?src-supplier=Newark; ComponentLink32URL: https://datasheet.octopart.com:443/ERA-2AEB103X-Panasonic-datasheet-34200419.pdf?src-supplier=Newark; ComponentLink32Description: https://datasheet.octopart.com:443/ERA-2AEB103X-Panasonic-datasheet-34200419.pdf?src-supplier=Newark; ComponentLink33URL: https://datasheet.octopart.com:443/ERA-2AEB103X-Panasonic-datasheet-7542722.pdf?src-supplier=element14+APAC; ComponentLink33Description: https://datasheet.octopart.com:443/ERA-2AEB103X-Panasonic-datasheet-7542722.pdf?src-supplier=element14+APAC; ComponentLink34URL: https://datasheet.octopart.com:443/ERA-2AEB103X-Panasonic-datasheet-154766165.pdf?src-supplier=Master+Electronics; ComponentLink34Description: https://datasheet.octopart.com:443/ERA-2AEB103X-Panasonic-datasheet-154766165.pdf?src-supplier=Master+Electronics; ComponentLink35URL: https://datasheet.octopart.com:443/ERA-2AEB103X-Panasonic-datasheet-46744048.pdf?src-supplier=RS+(Formerly+Allied+Electronics); ComponentLink35Description: https://datasheet.octopart.com:443/ERA-2AEB103X-Panasonic-datasheet-46744048.pdf?src-supplier=RS+(Formerly+Allied+Electronics); ComponentLink36URL: https://sigma.octopart.com:443/150570796/technical_drawing/Panasonic-ERA2AEB103X.pdf?src-supplier=Panasonic+SCT; ComponentLink36Description: https://sigma.octopart.com:443/150570796/technical_drawing/Panasonic-ERA2AEB103X.pdf?src-supplier=Panasonic+SCT; ComponentLink37URL: https://datasheet.octopart.com/ERA-2AEB103X-Panasonic-datasheet-78375410.pdf; ComponentLink37Description: https://datasheet.octopart.com/ERA-2AEB103X-Panasonic-datasheet-78375410.pdf; ComponentLink38URL: https://datasheet.octopart.com:443/ERA2AEB103X-Panasonic---ECG-datasheet-15994758.pdf?src-supplier=Farnell; ComponentLink38Description: https://datasheet.octopart.com:443/ERA2AEB103X-Panasonic---ECG-datasheet-15994758.pdf?src-supplier=Farnell; ComponentLink39URL: https://datasheet.octopart.com:443/ERA2AEB103X-Panasonic-datasheet-10050158.pdf?src-supplier=Arrow+Electronics; ComponentLink39Description: https://datasheet.octopart.com:443/ERA2AEB103X-Panasonic-datasheet-10050158.pdf?src-supplier=Arrow+Electronics; ComponentLink40URL: https://datasheet.octopart.com:443/ERA-2AEB103X-Panasonic-datasheet-33006989.pdf?src-supplier=Electro+Sonic; ComponentLink40Description: https://datasheet.octopart.com:443/ERA-2AEB103X-Panasonic-datasheet-33006989.pdf?src-supplier=Electro+Sonic
SW1 = CMP-08834-000028-1: SWITCH TACTILE SPST-NO 0.05A 12V; Switch Travel: 0.15mm; Throw Configuration: SPST; Current Rating: 50mA; Illumination Type: Non-Illuminated; Actuator Length: 0.4mm; Operating Force: 1.5N; Connector Type: SMD/SMT; Contact Resistance: 100mR; Actuator Type: Standard; Electrical Life: 200000Cycles; Switch Function: Off-Mom; Ratings: Dust Proof; Max Operating Temperature: 70°C; Weight: 0.022g; Series: B3U; Min Operating Temperature: -25°C; Voltage Rating (DC): 12V; Orientation: Straight; Package Quantity: 1000; Packaging: Tape and Reel; RoHS Compliant: Yes; REACH SVHC: No SVHC; Max Voltage Rating (DC): 12V; Mount: Surface Mount; Case/Package: SMD/SMT; Mechanical Life: 200000Cycles; Termination: SMD/SMT
SW2 = CMP-011-00006-2: Slide Switch, SPDT, 500 V, -20 to 70 degC, 3-Pin THD, RoHS, Bulk; Manufacturer: E-Switch; Voltage Rating (DC): 30V; Current Rating: 200mA; Operating Force: 250gf; Package Quantity: 1000; Contact Plating: Silver; Max Operating Temperature: 70°C; Min Operating Temperature: -20°C; Contact Material: Copper; Datasheet URL: https://www.e-switch.com/system/asset/product_line/data_sheet/119/EG.pdf; Contact Finish: Silver; Case/Package: EG1218; Voltage Rating (AC): 30V; Datasheet Version: Oct-15; Package Description: 3-Pin Through Hole Device, Body 11.6 x 4 mm, Pitch 2.5 mm; RoHS Compliant: True; Package Reference: EG1218; Manufacturer URL: http://www.e-switch.ch/en/; Throw Configuration: SPDT; Contact Current Rating: 200mA; Mounting Technology: TH; Packaging: Bulk; Pins: 3
U1 = STM32F765ZIT7: Integrated Circuit; Manufacturer_Name: STMicroelectronics; Datasheet Link: https://www.st.com/resource/en/datasheet/stm32f765bi.pdf; Height: 1.6mm; Manufacturer_Part_Number: STM32F765ZIT7; Mouser Part Number: 511-STM32F765ZIT7; Mouser Price/Stock: https://www.mouser.co.uk/ProductDetail/STMicroelectronics/STM32F765ZIT7?qs=lYGu3FyN48df6bb2YhdYOw%3D%3D; Arrow Part Number: STM32F765ZIT7; Arrow Price/Stock: https://www.arrow.com/en/products/stm32f765zit7/stmicroelectronics?utm_currency=USD&region=nac
Y1 = CMP-25159-260170-1: MEMS OSC XO 8.0000MHZ H/LV-CMOS; Frequency Stability: 25ppm; Frequency: 8MHz; Max Supply Current: 4.5mA; Min Operating Temperature: -40°C; RoHS Compliant: Yes; Series: SIT8008B; Mount: Surface Mount; Packaging: Cut Tape; Case/Package: SMD/SMT; Max Operating Temperature: 85°C